# Altium schematic sheet Universal-Power-Board.SchDoc
size A3
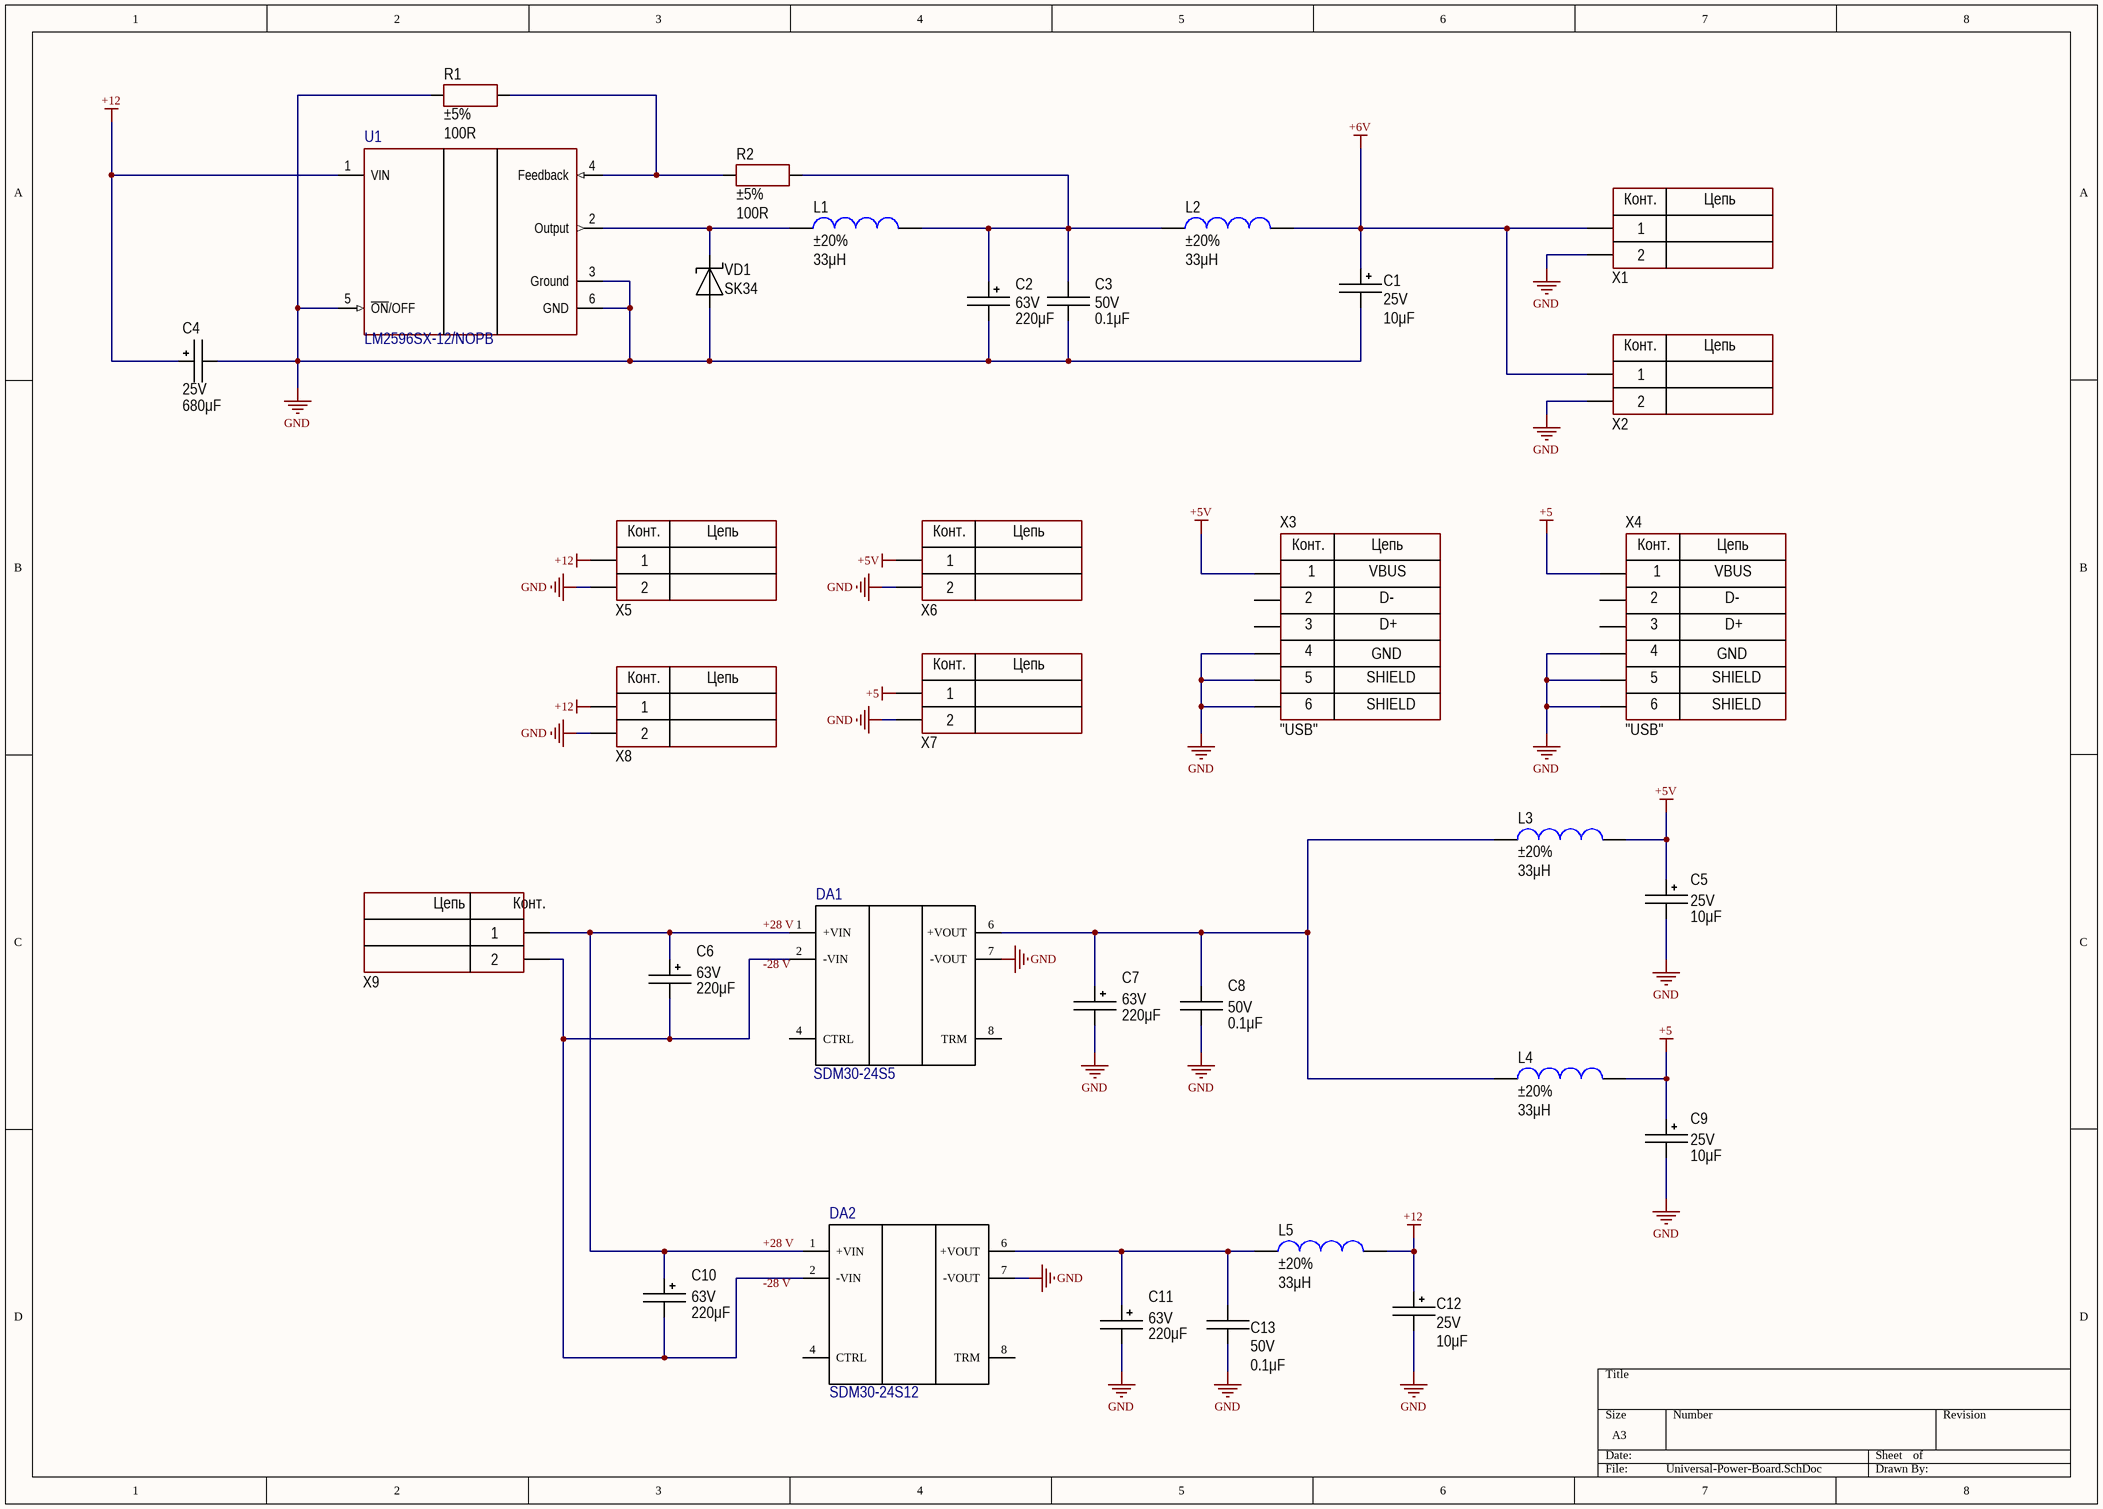
[diagram p0: Universal-Power-Board.SchDoc]

## Parts
C1  value 10μF  Voltage: 25V  [CAP: D6.3C2.5H11]
C2  value 220μF  Voltage: 63V  [CAP: D10C5H16]
C3  value 0.1μF  Voltage: 50V  [CAP: 1206]
C4  value 680μF  Voltage: 25V  [CAP: D10C5H16]
C5  value 10μF  Voltage: 25V  [CAP: D6.3C2.5H11]
C6  value 220μF  Voltage: 63V  [CAP: D10C5H16]
C7  value 220μF  Voltage: 63V  [CAP: D10C5H16]
C8  value 0.1μF  Voltage: 50V  [CAP: 1206]
C9  value 10μF  Voltage: 25V  [CAP: D6.3C2.5H11]
C10  value 220μF  Voltage: 63V  [CAP: D10C5H16]
C11  value 220μF  Voltage: 63V  [CAP: D10C5H16]
C12  value 10μF  Voltage: 25V  [CAP: D6.3C2.5H11]
C13  value 0.1μF  Voltage: 50V  [CAP: 1206]
DA1  SDM30-24S5  [SDM3024S5]
DA2  SDM30-24S12  [SDM3024S12]
L1  value 33μH  Tolerance: ±20%  [SRR1208-101YL]
L2  value 33μH  Tolerance: ±20%  [SRR1208-101YL]
L3  value 33μH  Tolerance: ±20%  [SRR1208-101YL]
L4  value 33μH  Tolerance: ±20%  [SRR1208-101YL]
L5  value 33μH  Tolerance: ±20%  [SRR1208-101YL]
R1  value 100R  Tolerance: ±5%  [RES: 1206]
R2  value 100R  Tolerance: ±5%  [RES: 1206]
U1  LM2596SX-12/NOPB  [FP-KTT0005B-MFG]
VD1  PartNumber: SK34  [DIODE: SMC]
X1  (no value)  [2EDGR-5.08-02P]
X2  (no value)  [2EDGR-5.08-02P]
X3  CommentText: "USB"  [FP-292303-4-MFG]
X4  CommentText: "USB"  [FP-292303-4-MFG]
X5  (no value)  [2EDGR-5.08-02P]
X6  (no value)  [2EDGR-5.08-02P]
X7  (no value)  [2EDGR-5.08-02P]
X8  (no value)  [2EDGR-5.08-02P]
X9  (no value)  [2EDGR-5.08-02P]

## Nets
+5: C9.1 L4.1 X4.1 X7.1
+5V: C5.1 L3.1 X3.1 X6.1
+6V: C1.1 L2.1 X1.1 X2.1
+12: C4.1 C12.1 L5.1 U1.1(VIN) X5.1 X8.1
GND: C1.2 C2.2 C3.1 C4.2 C5.2 C7.2 C8.1 C9.2 C11.2 C12.2 C13.1 DA1.7(-VOUT) DA2.7(-VOUT) R1.1 U1.3(Ground) U1.5(~{ON}/OFF) U1.6(GND) VD1.1 X1.2 X2.2 X3.4 X3.5 X3.6 X4.4 X4.5 X4.6 X5.2 X6.2 X7.2 X8.2
+28 V: C6.1 C10.1 DA1.1(+VIN) DA2.1(+VIN) X9.1
NetC2_1: C2.1 C3.2 L1.1 L2.2 R2.2
NetC6_2: C6.2 C10.2 DA1.2(-VIN) DA2.2(-VIN) X9.2
NetC7_1: C7.1 C8.2 DA1.6(+VOUT) L3.2 L4.2
NetC11_1: C11.1 C13.2 DA2.6(+VOUT) L5.2
NetL1_2: L1.2 U1.2(Output) VD1.2
NetR1_2: R1.2 R2.1 U1.4(Feedback)

Not connected (* = marked no-connect by the designer): DA1 4(CTRL) 8(TRM); DA2 4(CTRL) 8(TRM); X3 2 3; X4 2 3

## Notes on the sheet
- Labels drawn without touching a wire or pin: -28 V
- (in symbol 2EDGR-5.08-02P) Цепь; Конт.
- (in symbol Connector_USB_micro_B) Конт.; Цепь; VBUS; D-; D+; GND; SHIELD

## Library data of the parts
C1 C5 C9 C12 = Aluminium: Manufacturer: Wurth; PartNumber: 860080475013; ValueManufacturerPartNumber: Aluminium capacitor, 10μF, 25V, ±20%, 54mOhm, 14x10x5 mm, -55...+105°C; TypeCapacitor: Aluminium capacitor; Tolerance: ±20%; Impedance: 54mOhm; Package: 14x10x5 mm; HelpURL: https://www.digikey.com/product-detail/en/wurth-electronics-inc/860080475013/732-9029-1-ND/5728972; Temperature: -55...+105°C
C2 C6 C7 C10 C11 = Aluminium: Manufacturer: Wurth; PartNumber: 860080475013; ValueManufacturerPartNumber: Aluminium capacitor, 220μF, 63V, ±20%, 54mOhm, 14x10x5 mm, -55...+105°C; TypeCapacitor: Aluminium capacitor; Tolerance: ±20%; Impedance: 54mOhm; Package: 14x10x5 mm; HelpURL: https://www.digikey.com/product-detail/en/wurth-electronics-inc/860080475013/732-9029-1-ND/5728972; Temperature: -55...+105°C
C3 C8 C13 = Ceramic_1206: Manufacturer: Yageo; PartNumber: CC1206KRX7R9BB104; ValueManufacturerPartNumber: Ceramic capacitor, 0.1μF, X7R, ±10%, 50V, 1206, -55...+125°C; TypeCapacitor: Ceramic capacitor; Tolerance: ±10%; TypeDielectric: X7R; Package: 1206; HelpURL: https://www.digikey.com/product-detail/en/yageo/CC1206KRX7R9BB104/311-1179-1-ND/303089; Temperature: -55...+125°C
C4 = Aluminium: Manufacturer: Wurth; PartNumber: 860080475013; ValueManufacturerPartNumber: Aluminium capacitor, 680μF, 25V, ±20%, 54mOhm, 14x10x5 mm, -55...+105°C; TypeCapacitor: Aluminium capacitor; Tolerance: ±20%; Impedance: 54mOhm; Package: 14x10x5 mm; HelpURL: https://www.digikey.com/product-detail/en/wurth-electronics-inc/860080475013/732-9029-1-ND/5728972; Temperature: -55...+105°C
DA1 = SDM30-24S5: Power Supply; Manufacturer_Name: Mean Well; Datasheet Link: https://meanwell.hu/userfiles/webshop/products/attachments/SDM30-24S5.pdf; Height: 16mm; Manufacturer_Part_Number: SDM30-24S5
DA2 = SDM30-24S12: Power Supply; Manufacturer_Name: Mean Well; Datasheet Link: https://meanwell.hu/userfiles/webshop/products/attachments/SDM30-24S5.pdf; Height: 16mm; Manufacturer_Part_Number: SDM30-24S12
L1-L5 = Inductor_SDR0403: Manufacturer: Bourns; PartNumber: SDR0403-4R7ML; ValueManufacturerPartNumber: Fixed inductor, 33μH, ±20%, SDR0403, 1.7A, -40...+125°C; TypeInductor: Fixed inductor; MaxCurrent: 1.7A; Package: SDR0403; HelpURL: https://www.digikey.com/product-detail/en/bourns-inc/SDR0403-4R7ML/SDR0403-4R7MLCT-ND/2127096; Temperature: -40...+125°C
R1 R2 = Resistor_1206: Manufacturer: Yageo; PartNumber: RC1206JR-07100RL; ValueManufacturerPartNumber: Resistor film, 100R, ±5%, 1206, 0.25W, -55...+125°C; TypeResistor: Resistor film; Power: 0.25W; Package: 1206; HelpURL: https://www.digikey.com/product-detail/en/yageo/RC1206JR-07100RL/311-100ERCT-ND/732153; Temperature: -55...+125°C
U1 = CMP-04918-000013-1: IC REG BUCK 12V 3A TO263-5; Manufacturer: Texas Instruments; Max Duty Cycle: 100%; Max Junction Temp: +150°C; Min Supply Voltage: 4.5V; Max Supply Voltage: 40V; Standoff Height: 0mm; Switching Frequency: 150kHz; Nominal Supply Current: 5mA; Number Of Outputs: 1; Output Type: Fixed; Device Class L1: Integrated Circuits (ICs); ComponentLink2Description: Datasheet; Height: 4.8mm; Switching Topology: Buck; Device Class L2: Power Management ICs; Temperature Range Low: -40°C; Output Voltage: 12V; Lead Free: Yes; Digikey Description: IC REG BUCK 12V 3A TO263-5; Device Class L3: Voltage Regulators - Switching; Manufacturer Part Number: LM2596SX-12/NOPB; Octopart: https://octopart.com/lm2596sx-12%2Fnopb-texas+instruments-24812942; Mouser Description: SIMPLE SWITCHER® 4.5V to 40V, 3A Low Component Count Step-Down Regulator 5-DDPAK/TO-263; Package: KTT0005B; Output Current: 3A; Automotive: No; Temperature: -40°C to +125°C; RoHS: TRUE; Temperature Range High: +125°C; Category: IC; ComponentLink2URL: http://www.ti.com/lit/ds/symlink/lm2596.pdf
VD1 = Schottky_single: Manufacturer: Diodes Incorporated; ValueManufacturerPartNumber: Schottky diode, 80V, 500mA, 1V, 15pF, SOD-123, -55...+150°C; TypeDiode: Schottky diode; Voltage: 80V; Current: 500mA; VoltageDrop: 1V; RecoveryTime: 15pF; Package: SOD-123; HelpURL: https://www.digikey.com/product-detail/en/diodes-incorporated/MBR0580S1-7/MBR0580S1-7DICT-ND/5080371; Temperature: -55...+150°C
X1 X2 X5-X9 = 2EDGR-5.08-02P: Manufacturer: Connfly; ValueManufacturerPartNumber: Connector, 6pin, 2.54mm, 500VAC, 3A; PartNumber: PBS-6; TypeConnector: Connector; VoltageMax: 500VAC; Pitch: 2.54mm; CurrentMax: 3A; Multichannel: 6pin; CommentText: "Разъем"; HelpURL: https://www.chipdip.ru/product/pbs-6
X3 X4 = Connector_USB_micro_B: Manufacturer: Hirose Electric; ValueManufacturerPartNumber: USB micro B; PartNumber: ZX62-B-5PA; HelpURL: https://www.digikey.com/product-detail/en/hirose-electric-co-ltd/ZX62-B-5PA/H11579CT-ND/1851090; TypeConnector: USB micro B